# EAGLE schematic Schematic1 (EAGLE 9.6.2)
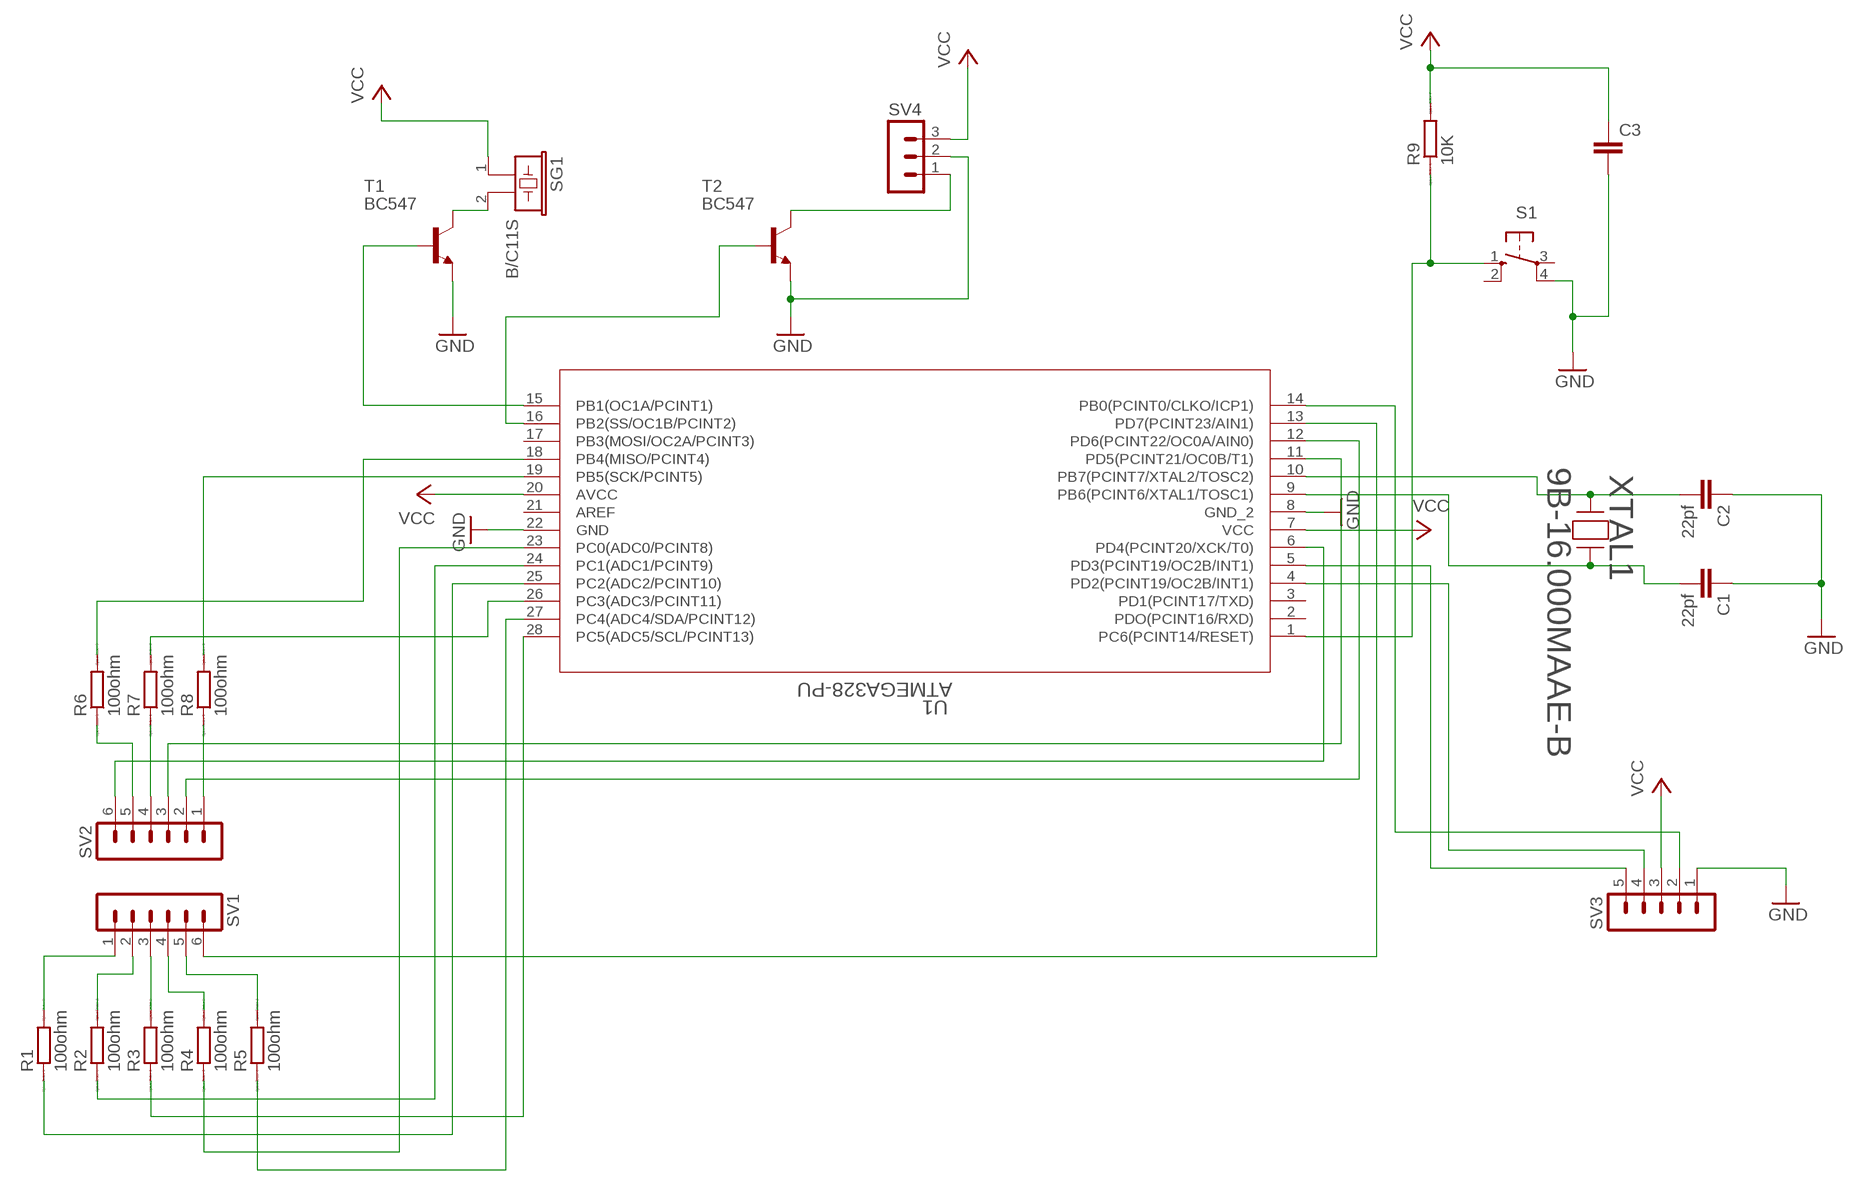
[diagram p0: schematic, sheet 1]

## Parts
C1  22pf  C2,5-3  [C2.5-3]
C2  22pf  C2,5-3  [C2.5-3]
C3  C5/3  [C5B3]
R1  100ohm  R0204/7  [0204/7]
R2  100ohm  R0204/7  [0204/7]
R3  100ohm  R0204/7  [0204/7]
R4  100ohm  R0204/7  [0204/7]
R5  100ohm  R0204/7  [0204/7]
R6  100ohm  R0204/7  [0204/7]
R7  100ohm  R0204/7  [0204/7]
R8  100ohm  R0204/7  [0204/7]
R9  10K  R0204/7  [0204/7]
S1  10-XX  [B3F-10XX]
SG1  B/C11S  [B/C11S]
SV1  MA06-1  [MA06-1]
SV2  MA06-1  [MA06-1]
SV3  MA05-1  [MA05-1]
SV4  MA03-1  [MA03-1]
T1  BC547  [TO92]
T2  BC547  [TO92]
U1  ATMEGA328-PU  [28P3_SPDIP28_SP_MCH]
XTAL1  9B-16.000MAAE-B  [9B-16.000MAAE-B_TXC]

## Nets
GND: C1.1 C2.1 C3.2 S1.4(P1) SV3.1 SV4.2 T1.1(E) T2.1(E) U1.8(GND_2) U1.22(GND)
N$1: R1.2 SV1.1
N$2: R1.1 U1.25(PC2(ADC2/PCINT10))
N$3: R2.2 SV1.2
N$4: R3.1 U1.28(PC5(ADC5/SCL/PCINT13))
N$5: R3.2 SV1.3
N$6: R4.2 SV1.4
N$7: R2.1 U1.24(PC1(ADC1/PCINT9))
N$8: SV1.6 U1.13(PD7(PCINT23/AIN1))
N$9: R4.1 U1.23(PC0(ADC0/PCINT8))
N$10: R5.2 SV1.5
N$11: R5.1 U1.27(PC4(ADC4/SDA/PCINT12))
N$12: R8.1 SV2.1
N$13: R8.2 U1.19(PB5(SCK/PCINT5))
N$14: SV2.2 U1.12(PD6(PCINT22/OC0A/AIN0))
N$15: SV2.3 U1.11(PD5(PCINT21/OC0B/T1))
N$16: R7.1 SV2.4
N$17: R7.2 U1.26(PC3(ADC3/PCINT11))
N$18: R6.1 SV2.5
N$19: R6.2 U1.18(PB4(MISO/PCINT4))
N$20: SV2.6 U1.6(PD4(PCINT20/XCK/T0))
N$21: C1.2 U1.9(PB6(PCINT6/XTAL1/TOSC1)) XTAL1.2
N$22: C2.2 U1.10(PB7(PCINT7/XTAL2/TOSC2)) XTAL1.1
N$23: T1.2(B) U1.15(PB1(OC1A/PCINT1))
N$24: SV3.2 SV3.5 U1.5(PD3(PCINT19/OC2B/INT1)) U1.14(PB0(PCINT0/CLKO/ICP1))
N$25: SV3.4 U1.4(PD2(PCINT19/OC2B/INT1))
N$26: SG1.2 T1.3(C)
N$27: T2.2(B) U1.16(PB2(SS/OC1B/PCINT2))
N$28: SV4.1 T2.3(C)
N$29: R9.1 S1.1(S) U1.1(PC6(PCINT14/RESET))
VCC: C3.1 R9.2 SG1.1 SV3.3 SV4.3 U1.7(VCC) U1.20(AVCC)
Unconnected: S1.2(S1) S1.3(P) U1.2(PDO(PCINT16/RXD)) U1.3(PD1(PCINT17/TXD)) U1.17(PB3(MOSI/OC2A/PCINT3)) U1.21(AREF)

## Library data of the parts
C1-C3 = capacitor-wima:C: CAPACITOR naming: grid - package width
R1-R9 = eagle-ltspice:R: RESISTOR, European symbol; SPICEMODEL: NONE; SPICEPREFIX: R
S1 = switch-omron:10-XX: OMRON SWITCH; MPN: B3F-1000; OC_FARNELL: 176432; OC_NEWARK: 36M3542
SG1 = buzzer:B/C11S: BUZZER Source: Buerklin; OC_FARNELL: unknown; OC_NEWARK: unknown
SV1 SV2 = con-lstb:MA06-1: PIN HEADER; OC_FARNELL: unknown; OC_NEWARK: unknown
SV3 = con-lstb:MA05-1: PIN HEADER; OC_FARNELL: unknown; OC_NEWARK: unknown
SV4 = con-lstb:MA03-1: PIN HEADER; OC_FARNELL: unknown; OC_NEWARK: unknown
T1 T2 = transistor:BC547: NPN TRANSISTOR
U1 = ATMEGA328PU:ATMEGA328-PU; COPYRIGHT: Copyright (C) 2023 Ultra Librarian. All rights reserved.; MANUFACTURER_PART_NUMBER: ATMEGA328-PU; MFR_NAME: Microchip
XTAL1 = cristaloss16mhz:9B-16.000MAAE-B; COPYRIGHT: Copyright (C) 2023 Ultra Librarian. All rights reserved.; MANUFACTURER_PART_NUMBER: 9B-16.000MAAE-B; MFR_NAME: TXC